# Altium schematic sheet ESP32 with USBC.SchDoc (part 2 of 3)
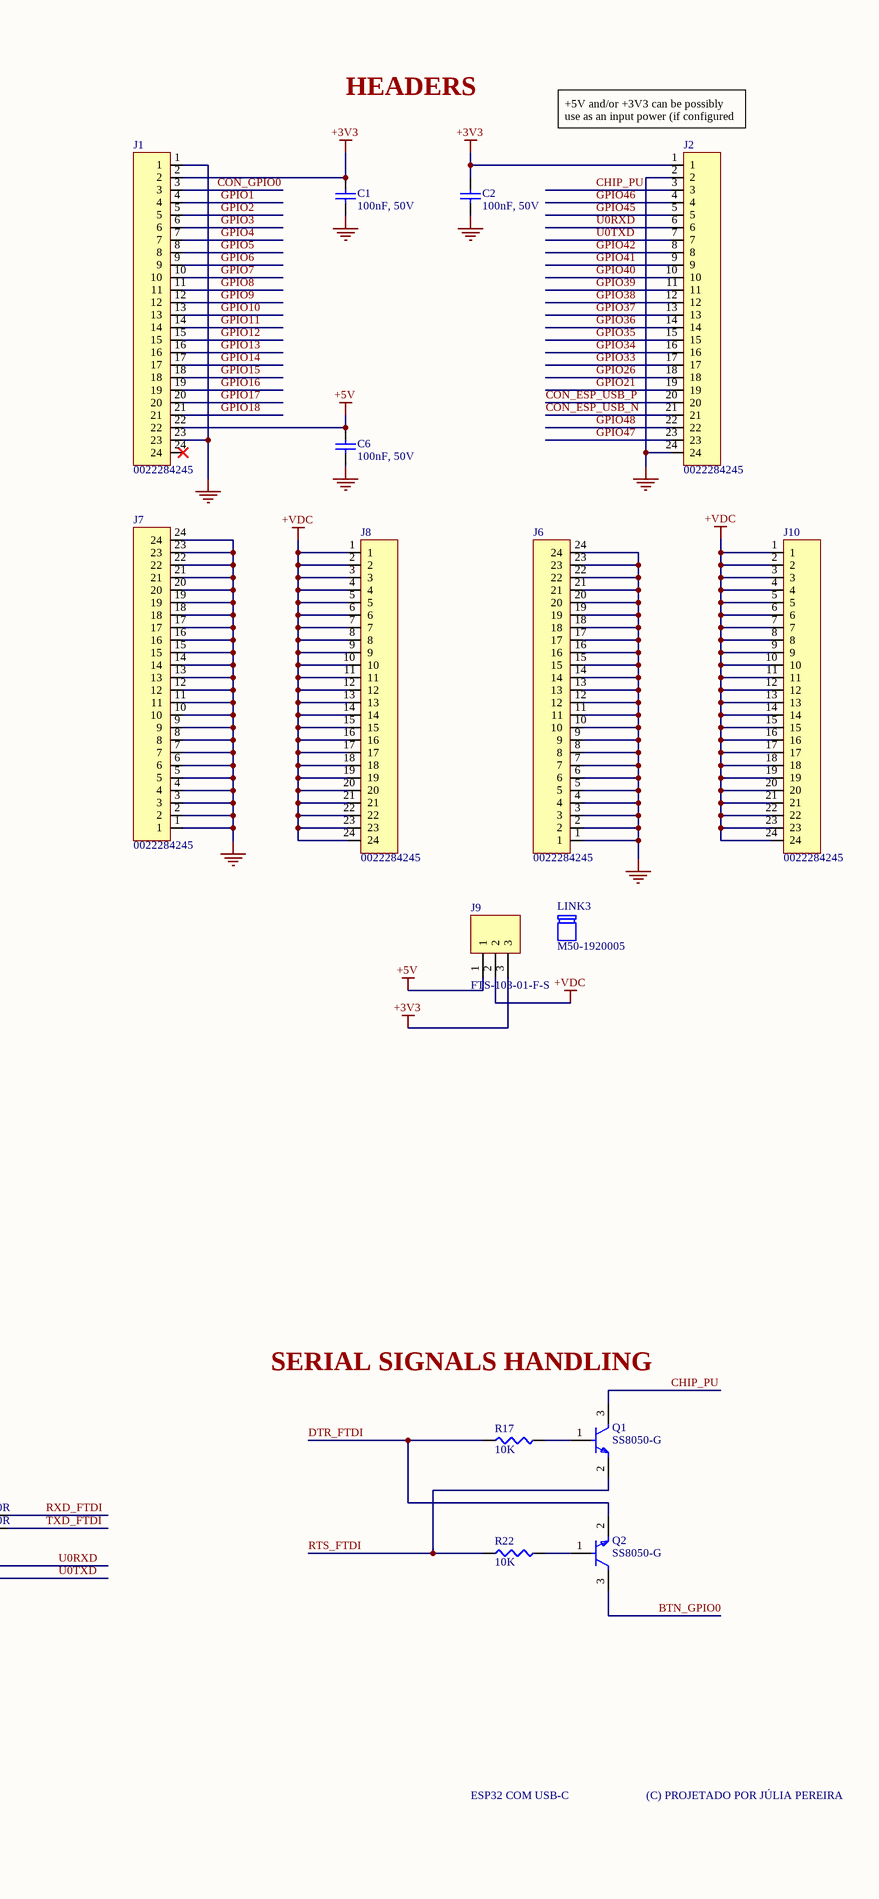
[diagram p2: ESP32 with USBC.SchDoc, right]
## Library data of the parts
C1 C2 C4-C7 C9 C10 C15 C17 = CL05B104KB54PNC: CAP CER 0.1UF 50V X7R 0402; Manufacturer: Samsung Electro-Mechanics; Dielectric Material: Ceramic; Tolerance: 10%; Supplier: DigiKey; Supplier Part Number: 1276-CL05B104KB54PNCCT-ND; Manufacturer Part Number: CL05B104KB54PNC; RoHS: Compliant; Category: Ceramic Capacitors; Stock: 403524; Pricing: 1=0.1, 10=0.048, 50=0.0326, 100=0.0279, 500=0.02002 (USD); Value: 100nF; Case/Package: 0402; China RoHS: Compliant; Country of Origin: Mainland China, Philippines, South Korea; Export Control Classification Number (ECCN) Code: EAR99; Height: 500µm; Harmonized Tariff Schedule (HTS) Code: 8532.24.00.20; Introduction Date: 2018-07-31; Length: 1mm; Lifecycle Status: Production; Material: Ceramic; Max Operating Temperature: 125°C; Min Operating Temperature: -55°C; Mounting Technology: Surface Mount; Number of Terminals: 2; Ratings: AEC-Q200; REACH SVHC: Yes; Schedule B: 8532240020, 8532240020|8532240020|8532240020|8532240020|8532240020|8532240020|8532240020|8532240020|8532240020|8532240020|8532240020|8532240020|8532240020|8532240020|8532240020|8532240020|8532240020|8532240020|8532240020|8532240020|8532240020|8532240020|8532240020|85; Voltage Rating: 50V; Voltage Rating (DC): 50V; Width: 500µm; ComponentLink1URL: https://datasheet.octopart.com:443/CL05B104KB54PNC-Samsung-Electro-Mechanics-datasheet-182018727.pdf?src-supplier=IHS; ComponentLink1Description: https://datasheet.octopart.com:443/CL05B104KB54PNC-Samsung-Electro-Mechanics-datasheet-182018727.pdf?src-supplier=IHS; ComponentLink2URL: https://datasheet.octopart.com:443/CL05B104KB54PNC-Samsung-Electro-Mechanics-datasheet-138685816.pdf?src-supplier=Samsung+SCT; ComponentLink2Description: https://datasheet.octopart.com:443/CL05B104KB54PNC-Samsung-Electro-Mechanics-datasheet-138685816.pdf?src-supplier=Samsung+SCT; ComponentLink3URL: https://datasheet.octopart.com:443/CL05B104KB54PNC-Samsung-datasheet-8326407.pdf?src-supplier=TME; ComponentLink3Description: https://datasheet.octopart.com:443/CL05B104KB54PNC-Samsung-datasheet-8326407.pdf?src-supplier=TME
C3 C8 C13 C18 = CL05A475MO5NUNC: 4.7 µF ±20% 16V Capacitor de cerâmica X5R 0402 (métrico 1005); Manufacturer: Samsung Electro-Mechanics; Value: 4.7µF; Dielectric Material: Ceramic; Supplier: DigiKey; Supplier Part Number: 1276-6836-6-ND; Manufacturer Part Number: CL05A475MO5NUNC; RoHS: Compliant; Category: Ceramic Capacitors; Stock: 1034605; Pricing: 1=0.52, 10=0.316, 50=0.2358, 100=0.211, 500=0.16936 (USD); Case/Package: 0402; Case Code (Imperial): 0402; Case Code (Metric): 1005; China RoHS: Compliant; Dielectric: X5R; Height: 500µm; Length: 1mm; Lifecycle Status: Production; Material: Ceramic; Max Operating Temperature: 85°C; Min Operating Temperature: -55°C; Mounting Technology: Surface Mount; Number of Terminals: 2; REACH SVHC: Yes; Schedule B: 8532240020, 8532240020|8532240020, 8532240020|8532240020|8532240020, 8532240020|8532240020|8532240020|8532240020; Thickness: 558.8µm; Tolerance: 20%; Voltage Rating: 16V; Voltage Rating (DC): 16V; Width: 500µm; ComponentLink1URL: https://datasheet.octopart.com:443/CL05A475MO5NUNC-Samsung-Electro-Mechanics-datasheet-178175196.pdf?src-supplier=Farnell; ComponentLink1Description: https://datasheet.octopart.com:443/CL05A475MO5NUNC-Samsung-Electro-Mechanics-datasheet-178175196.pdf?src-supplier=Farnell; ComponentLink2URL: https://datasheet.octopart.com:443/CL05A475MO5NUNC-Samsung-Electro-Mechanics-datasheet-123102911.pdf?src-supplier=Future+Electronics; ComponentLink2Description: https://datasheet.octopart.com:443/CL05A475MO5NUNC-Samsung-Electro-Mechanics-datasheet-123102911.pdf?src-supplier=Future+Electronics; ComponentLink3URL: https://datasheet.octopart.com:443/CL05A475MO5NUNC-Samsung-Electro-Mechanics-datasheet-110226225.pdf?src-supplier=Future+Electronics; ComponentLink3Description: https://datasheet.octopart.com:443/CL05A475MO5NUNC-Samsung-Electro-Mechanics-datasheet-110226225.pdf?src-supplier=Future+Electronics; ComponentLink4URL: https://datasheet.octopart.com:443/CL05A475MO5NUNC-Samsung-Electro-Mechanics-datasheet-83567908.pdf?src-supplier=Future+Electronics; ComponentLink4Description: https://datasheet.octopart.com:443/CL05A475MO5NUNC-Samsung-Electro-Mechanics-datasheet-83567908.pdf?src-supplier=Future+Electronics; ComponentLink5URL: https://datasheet.octopart.com:443/CL05A475MO5NUNC-Samsung-Electro-Mechanics-datasheet-68297032.pdf?src-supplier=Future+Electronics; ComponentLink5Description: https://datasheet.octopart.com:443/CL05A475MO5NUNC-Samsung-Electro-Mechanics-datasheet-68297032.pdf?src-supplier=Future+Electronics; ComponentLink6URL: https://datasheet.octopart.com:443/CL05A475MO5NUNC-Samsung-Electro-Mechanics-datasheet-87580057.pdf?src-supplier=Future+Electronics; ComponentLink6Description: https://datasheet.octopart.com:443/CL05A475MO5NUNC-Samsung-Electro-Mechanics-datasheet-87580057.pdf?src-supplier=Future+Electronics; ComponentLink7URL: https://datasheet.octopart.com:443/CL05A475MO5NUNC-Samsung-Electro-Mechanics-datasheet-149136694.pdf?src-supplier=Future+Electronics; ComponentLink7Description: https://datasheet.octopart.com:443/CL05A475MO5NUNC-Samsung-Electro-Mechanics-datasheet-149136694.pdf?src-supplier=Future+Electronics
C11 C12 C14 = CL05A106MP8NUB8: 10 µF ±20% 10V Capacitor de cerâmica X5R 0402 (métrico 1005); Manufacturer: Samsung Electro-Mechanics; Value: 10µF; Dielectric Material: Ceramic; Supplier: DigiKey; Supplier Part Number: 1276-6830-6-ND; Manufacturer Part Number: CL05A106MP8NUB8; RoHS: Compliant; Category: Ceramic Capacitors; Stock: 1026444; Pricing: 1=0.44, 10=0.26, 50=0.1902, 100=0.1688, 500=0.13288 (USD); Case/Package: 0402; Case Code (Imperial): 0402; Case Code (Metric): 1005; China RoHS: Compliant; Country of Origin: Mainland China, Philippines, South Korea; Export Control Classification Number (ECCN) Code: EAR99; Height: 800µm; Harmonized Tariff Schedule (HTS) Code: 8532.24.00.20; Introduction Date: 2014-02-27; Length: 1mm; Lifecycle Status: Production; Material: Ceramic; Max Operating Temperature: 85°C; Min Operating Temperature: -55°C; Mounting Technology: Surface Mount; Number of Terminals: 2; REACH SVHC: Yes; Schedule B: 8532240020, 8532240020|8532240020, 8532240020|8532240020|8532240020, 8532240020|8532240020|8532240020|8532240020; Thickness: 889µm; Tolerance: 20%; Voltage Rating: 10V; Voltage Rating (DC): 10V; Width: 500µm; ComponentLink1URL: https://datasheet.octopart.com:443/CL05A106MP8NUB8-Samsung-Electro-Mechanics-datasheet-136460857.pdf?src-supplier=IHS; ComponentLink1Description: https://datasheet.octopart.com:443/CL05A106MP8NUB8-Samsung-Electro-Mechanics-datasheet-136460857.pdf?src-supplier=IHS; ComponentLink2URL: https://datasheet.octopart.com:443/CL05A106MP8NUB8-Samsung-Electro-Mechanics-datasheet-181551178.pdf?src-supplier=Newark; ComponentLink2Description: https://datasheet.octopart.com:443/CL05A106MP8NUB8-Samsung-Electro-Mechanics-datasheet-181551178.pdf?src-supplier=Newark; ComponentLink3URL: https://datasheet.octopart.com:443/CL05A106MP8NUB8-Samsung-Electro-Mechanics-datasheet-136031724.pdf?src-supplier=Newark; ComponentLink3Description: https://datasheet.octopart.com:443/CL05A106MP8NUB8-Samsung-Electro-Mechanics-datasheet-136031724.pdf?src-supplier=Newark; ComponentLink4URL: https://datasheet.octopart.com:443/CL05A106MP8NUB8-Samsung-Electro-Mechanics-datasheet-141346815.pdf?src-supplier=Samsung+SCT; ComponentLink4Description: https://datasheet.octopart.com:443/CL05A106MP8NUB8-Samsung-Electro-Mechanics-datasheet-141346815.pdf?src-supplier=Samsung+SCT; ComponentLink5URL: https://datasheet.octopart.com:443/CL05A106MP8NUB8-Samsung-Electro-Mechanics-datasheet-110326781.pdf?src-supplier=Future+Electronics; ComponentLink5Description: https://datasheet.octopart.com:443/CL05A106MP8NUB8-Samsung-Electro-Mechanics-datasheet-110326781.pdf?src-supplier=Future+Electronics; ComponentLink6URL: https://datasheet.octopart.com:443/CL05A106MP8NUB8-Samsung-Electro-Mechanics-datasheet-96443587.pdf?src-supplier=Future+Electronics; ComponentLink6Description: https://datasheet.octopart.com:443/CL05A106MP8NUB8-Samsung-Electro-Mechanics-datasheet-96443587.pdf?src-supplier=Future+Electronics; ComponentLink7URL: https://datasheet.octopart.com:443/CL05A106MP8NUB8-Samsung-Electro-Mechanics-datasheet-68297032.pdf?src-supplier=Future+Electronics; ComponentLink7Description: https://datasheet.octopart.com:443/CL05A106MP8NUB8-Samsung-Electro-Mechanics-datasheet-68297032.pdf?src-supplier=Future+Electronics; ComponentLink8URL: https://datasheet.octopart.com:443/CL05A106MP8NUB8-Samsung-Electro-Mechanics-datasheet-86032222.pdf?src-supplier=Future+Electronics; ComponentLink8Description: https://datasheet.octopart.com:443/CL05A106MP8NUB8-Samsung-Electro-Mechanics-datasheet-86032222.pdf?src-supplier=Future+Electronics
C16 = CL05A105KL5NRNC: 1 µF ±10% 35V Capacitor de cerâmica X5R 0402 (métrico 1005); Manufacturer: Samsung Electro-Mechanics; Value: 1µF; Dielectric Material: Ceramic; Supplier: DigiKey; Supplier Part Number: 1276-6796-2-ND; Manufacturer Part Number: CL05A105KL5NRNC; RoHS: Compliant; Category: Ceramic Capacitors; Stock: 483880; Pricing: 10000=0.07511, 30000=0.06916 (USD); Case/Package: 0402; Case Code (Imperial): 0402; Case Code (Metric): 1005; China RoHS: Compliant; Country of Origin: Mainland China, Philippines, South Korea; Export Control Classification Number (ECCN) Code: EAR99; Height: 550µm; Harmonized Tariff Schedule (HTS) Code: 8532.24.00.20; Introduction Date: 2013-03-18; Length: 990.6µm; Lifecycle Status: Production; Material: Ceramic; Max Operating Temperature: 85°C; Min Operating Temperature: -55°C; Mounting Technology: Surface Mount; Number of Terminals: 2; REACH SVHC: Yes; Schedule B: 8532240020, 8532240020|8532240020|8532240020|8532240020|8532240020; Thickness: 558.8µm; Tolerance: 10%; Voltage Rating: 35V; Voltage Rating (DC): 35V; Width: 508µm; ComponentLink1URL: https://datasheet.octopart.com:443/CL05A105KL5NRNC-Samsung-Electro-Mechanics-datasheet-182018568.pdf?src-supplier=IHS; ComponentLink1Description: https://datasheet.octopart.com:443/CL05A105KL5NRNC-Samsung-Electro-Mechanics-datasheet-182018568.pdf?src-supplier=IHS; ComponentLink2URL: https://datasheet.octopart.com:443/CL05A105KL5NRNC-Samsung-Electro-Mechanics-datasheet-141346806.pdf?src-supplier=Samsung+SCT; ComponentLink2Description: https://datasheet.octopart.com:443/CL05A105KL5NRNC-Samsung-Electro-Mechanics-datasheet-141346806.pdf?src-supplier=Samsung+SCT; ComponentLink3URL: https://datasheet.octopart.com:443/CL05A105KL5NRNC-Samsung-datasheet-8326407.pdf?src-supplier=TME; ComponentLink3Description: https://datasheet.octopart.com:443/CL05A105KL5NRNC-Samsung-datasheet-8326407.pdf?src-supplier=TME
D1 = VLMTG1500-GS08: Verde 528nm Indicadores LED - Discreto 2,8V 0402 (métrico 1005); Manufacturer: Vishay; Forward Current: 20mA; Forward Voltage: 3.1V; Luminous Intensity: 28mcd; Number of Circuits: 1; Peak Wavelength: 527.5nm; Reverse Voltage: 5V; Shape: Rectangular; Viewing Angle: 130°; Supplier: DigiKey; Supplier Part Number: 751-VLMTG1500-GS08CT-ND; Manufacturer Part Number: VLMTG1500-GS08; RoHS: Compliant; Category: LEDs; Stock: 82551; Pricing: 1=0.35, 10=0.238, 100=0.1681, 500=0.1365, 1000=0.12606 (USD); Country of Origin: Mainland China; Height: 350µm; Harmonized Tariff Schedule (HTS) Code: 8541.40.20.00; Introduction Date: 2017-05-22; Lifecycle Status: Production; Max Operating Temperature: 80°C; Min Operating Temperature: -20°C; Mounting Technology: Surface Mount; Number of Terminals: 2; Terminal Pitch: 675µm; ComponentLink1URL: https://datasheet.octopart.com:443/VLMTG1500-GS08-Vishay-datasheet-181477802.pdf?src-supplier=IHS; ComponentLink1Description: https://datasheet.octopart.com:443/VLMTG1500-GS08-Vishay-datasheet-181477802.pdf?src-supplier=IHS; ComponentLink2URL: http://sigma.octopart.com:80/rohs_statement/Vishay-company-15.pdf?src-supplier=Compliance+Statements; ComponentLink2Description: http://sigma.octopart.com:80/rohs_statement/Vishay-company-15.pdf?src-supplier=Compliance+Statements
D2 D5 D6 = VLMS1500-GS08: LED Uni-Color Super Red 639nm 2-Pin Chip 0402(1006Metric) T/R; Manufacturer: Vishay; Dominant Wavelength: 631nm; Forward Current: 30mA; Forward Voltage: 2.4V; Lens Style: Rectangular, Square; Luminous Intensity: 18mcd; Number of Circuits: 1; Power Rating: 75mW; Reverse Voltage: 5V; Shape: Rectangular; Test Current: 20mA; Viewing Angle: 130°; Supplier: DigiKey; Supplier Part Number: VLMS1500-GS08CT-ND; Manufacturer Part Number: VLMS1500-GS08; RoHS: Compliant; Category: LEDs; Stock: 92678; Pricing: 1=0.26, 10=0.177, 100=0.1241, 500=0.09986, 1000=0.09182 (USD); Case/Package: 0402; Case Code (Imperial): 0402; Case Code (Metric): 1005; Color: Red; Country of Origin: Mainland China; Height: 350µm; Harmonized Tariff Schedule (HTS) Code: 8541.40.20.00; Illumination Color: Red; Introduction Date: 2012-07-08; Lead Free: Lead Free; Length: 1mm; Lifecycle Status: Production; Max Operating Temperature: 85°C; Min Operating Temperature: -30°C; Mounting Technology: Surface Mount; Number of LEDs: 1; Pins: 2; Number of Terminals: 2; Packaging: Cut Tape; Peak Wavelength: 631nm; Radiation Hardening: No; REACH SVHC: Yes; Schedule B: 8541402000, 8541402000|8541402000|8541402000|8541402000|8541402000; Terminal Pitch: 675µm; Wavelength: 631nm; Width: 500µm; ComponentLink1URL: https://datasheet.octopart.com:443/VLMS1500-GS08-Vishay-datasheet-181477802.pdf?src-supplier=IHS; ComponentLink1Description: https://datasheet.octopart.com:443/VLMS1500-GS08-Vishay-datasheet-181477802.pdf?src-supplier=IHS; ComponentLink2URL: https://datasheet.octopart.com:443/VLMS1500-GS08-Vishay-datasheet-21227148.pdf?src-supplier=Future+Electronics; ComponentLink2Description: https://datasheet.octopart.com:443/VLMS1500-GS08-Vishay-datasheet-21227148.pdf?src-supplier=Future+Electronics; ComponentLink3URL: https://datasheet.octopart.com:443/VLMS1500-GS08-Vishay-datasheet-102762782.pdf?src-supplier=Future+Electronics; ComponentLink3Description: https://datasheet.octopart.com:443/VLMS1500-GS08-Vishay-datasheet-102762782.pdf?src-supplier=Future+Electronics; ComponentLink4URL: https://datasheet.octopart.com:443/VLMS1500-GS08-Vishay-datasheet-33014519.pdf?src-supplier=element14+APAC; ComponentLink4Description: https://datasheet.octopart.com:443/VLMS1500-GS08-Vishay-datasheet-33014519.pdf?src-supplier=element14+APAC; ComponentLink5URL: https://datasheet.octopart.com:443/VLMS1500-GS08-Vishay-datasheet-68326145.pdf?src-supplier=TME; ComponentLink5Description: https://datasheet.octopart.com:443/VLMS1500-GS08-Vishay-datasheet-68326145.pdf?src-supplier=TME; ComponentLink6URL: https://datasheet.octopart.com:443/VLMS1500-GS08-Vishay-Siliconix-datasheet-62309867.pdf?src-supplier=RS+(Formerly+Allied+Electronics); ComponentLink6Description: https://datasheet.octopart.com:443/VLMS1500-GS08-Vishay-Siliconix-datasheet-62309867.pdf?src-supplier=RS+(Formerly+Allied+Electronics); ComponentLink7URL: https://datasheet.octopart.com:443/VLMS1500-GS08-Vishay-datasheet-62332426.pdf?src-supplier=Newark; ComponentLink7Description: https://datasheet.octopart.com:443/VLMS1500-GS08-Vishay-datasheet-62332426.pdf?src-supplier=Newark; ComponentLink8URL: https://datasheet.octopart.com/VLMS1500-GS08-Vishay-datasheet-16093911.pdf; ComponentLink8Description: https://datasheet.octopart.com/VLMS1500-GS08-Vishay-datasheet-16093911.pdf; ComponentLink9URL: http://sigma.octopart.com:80/rohs_statement/Vishay-company-15.pdf?src-supplier=Compliance+Statements; ComponentLink9Description: http://sigma.octopart.com:80/rohs_statement/Vishay-company-15.pdf?src-supplier=Compliance+Statements
D3 D4 = USBLC6-2SC6: STMicroelectronics Uni-Directional TVS Diode Array, 17V Vcl Max, SMD, SOT-23, 6V Vbr Min; Value: 2.5pF; Data Rate: 480Mbps; Direction: Unidirectional; Element Configuration: Dual; ESD Protection: Yes; Forward Voltage: 1.1V; Leakage Current: 150nA; Max Junction Temperature (Tj): 125°C; Max Repetitive Reverse Voltage (Vrrm): 5.25V; Number of Bidirectional Channels: 2; Number of Elements: 1; Peak Pulse Current: 5A; Reverse Standoff Voltage: 5V; Test Current: 1mA; Supplier: DigiKey; Supplier Part Number: 497-5235-6-ND; Manufacturer: STMicroelectronics; Manufacturer Part Number: USBLC6-2SC6; RoHS: Compliant; Category: TVS Diodes; Pricing: 1=0.54, 10=0.329, 50=0.2384, 100=0.2088, 500=0.15662 (USD); Breakdown Voltage: 6V; Case/Package: SOT-23; China RoHS: Compliant; Clamping Voltage: 17V; Contact Plating: Tin; Country of Origin: Mainland China; Depth: 1.75mm; Export Control Classification Number (ECCN) Code: EAR99; Height: 1.45mm; Harmonized Tariff Schedule (HTS) Code: 8541.10.00.50; Introduction Date: 2005-03-15; Lead Free: Lead Free; Length: 3.05mm; Lifecycle Status: Production; Max Breakdown Voltage: 6V; Max Operating Temperature: 125°C; Max Reverse Leakage Current: 150nA; Min Breakdown Voltage: 6V; Min Operating Temperature: -40°C; Mounting Technology: Surface Mount; Number of Channels: 2; Pins: 6; Number of Terminals: 6; Operating Supply Voltage: 1.1V; Peak Reverse Current: 150nA; Polarity: Unidirectional; Power Line Protection: Yes; Radiation Hardening: No; REACH SVHC: Yes; Reverse Breakdown Voltage: 6V; Schedule B: 8536300000, 8536300000|8536300000|8536300000|8536300000|8536300000|8536300000|8536300000|8536300000|8536300000|8536300000|8536300000|8536300000|8536300000|8536300000|8536300000|8536300000|8536300000|8536300000|8536300000|8536300000|8536300000|8536300000|8536300000|85; Termination: SMD/SMT; Width: 1.75mm; Working Voltage: 5V; ComponentLink1URL: https://datasheet.octopart.com:443/USBLC6-2SC6-STMicroelectronics-datasheet-10412581.pdf?src-supplier=Newark; ComponentLink1Description: https://datasheet.octopart.com:443/USBLC6-2SC6-STMicroelectronics-datasheet-10412581.pdf?src-supplier=Newark; ComponentLink2URL: https://datasheet.octopart.com:443/USBLC6-2SC6-STMicroelectronics-datasheet-181961833.pdf?src-supplier=Newark; ComponentLink2Description: https://datasheet.octopart.com:443/USBLC6-2SC6-STMicroelectronics-datasheet-181961833.pdf?src-supplier=Newark; ComponentLink3URL: https://datasheet.octopart.com:443/USBLC6-2SC6-STMicroelectronics-datasheet-525477.pdf?src-supplier=Factory+Futures; ComponentLink3Description: https://datasheet.octopart.com:443/USBLC6-2SC6-STMicroelectronics-datasheet-525477.pdf?src-supplier=Factory+Futures; ComponentLink4URL: https://datasheet.octopart.com:443/USBLC6-2SC6-STMicroelectronics-datasheet-82998616.pdf?src-supplier=Farnell; ComponentLink4Description: https://datasheet.octopart.com:443/USBLC6-2SC6-STMicroelectronics-datasheet-82998616.pdf?src-supplier=Farnell; ComponentLink5URL: https://datasheet.octopart.com:443/USBLC6-2SC6-STMicroelectronics-datasheet-46285.pdf?src-supplier=Farnell; ComponentLink5Description: https://datasheet.octopart.com:443/USBLC6-2SC6-STMicroelectronics-datasheet-46285.pdf?src-supplier=Farnell; ComponentLink6URL: https://datasheet.octopart.com:443/USBLC6-2SC6-STMicroelectronics-datasheet-14050643.pdf?src-supplier=iiiC; ComponentLink6Description: https://datasheet.octopart.com:443/USBLC6-2SC6-STMicroelectronics-datasheet-14050643.pdf?src-supplier=iiiC; ComponentLink7URL: https://datasheet.octopart.com:443/USBLC6-2SC6-STMicroelectronics-datasheet-10521292.pdf?src-supplier=Jameco+(USA); ComponentLink7Description: https://datasheet.octopart.com:443/USBLC6-2SC6-STMicroelectronics-datasheet-10521292.pdf?src-supplier=Jameco+(USA)
J1 J2 J6-J8 J10 = 0022284245: Conector barra de pinos Furo passante 24 position 0,100" (2,54mm); Manufacturer: Molex; Manufacturer Lifecycle Status: ACTIVE; Contact Resistance: 10mΩ; Current Rating: 4A; Gender: Male; Insulation Resistance: 1GΩ; Number of Circuits: 24; Operating Force: 4.9N; Pitch: 2.54mm; Plating: Tin; Plating Thickness: 381nm; Ratings: CSA; Supplier: DigiKey; Supplier Part Number: 900-0022284245-ND; Manufacturer Part Number: 22-28-4245; RoHS: Compliant; Category: Headers and Wire Housings; Stock: 574; Pricing: 1=4.05, 10=3.444, 100=2.9267, 500=2.61254, 1000=2.48792 (USD); China RoHS: Compliant; Color: Black; Contact Material: Brass; Contact Plating: Gold; Country of Origin: US; Export Control Classification Number (ECCN) Code: EAR99; Housing Color: Black; Harmonized Tariff Schedule (HTS) Code: 8536.69.40.40; Insulation Color: Black; Introduction Date: 1994-12-01; Lead Free: Lead Free; Lifecycle Status: Production; Max Operating Temperature: 75°C; Min Operating Temperature: -40°C; Mounting Technology: Through Hole; Number of Contacts: 24; Pins: 24; Number of Positions: 24; Number of Rows: 1; Orientation: Vertical; Packaging: Bulk; REACH SVHC: Yes; Schedule B: 8536694040, 8536694040|8536694040|8536694040|8536694040|8536694040; Terminal Pitch: 2.54mm; Termination: Solder; ComponentLink1URL: https://datasheet.octopart.com:443/22-28-4245-Molex-datasheet-166051265.pdf?src-supplier=IHS; ComponentLink1Description: https://datasheet.octopart.com:443/22-28-4245-Molex-datasheet-166051265.pdf?src-supplier=IHS; ComponentLink2URL: https://datasheet.octopart.com:443/022284245-Molex-datasheet-8337137.pdf?src-supplier=Arrow+Electronics; ComponentLink2Description: https://datasheet.octopart.com:443/022284245-Molex-datasheet-8337137.pdf?src-supplier=Arrow+Electronics; ComponentLink3URL: https://datasheet.octopart.com:443/22-28-4245-Molex-datasheet-16300812.pdf?src-supplier=Molex; ComponentLink3Description: https://datasheet.octopart.com:443/22-28-4245-Molex-datasheet-16300812.pdf?src-supplier=Molex; ComponentLink4URL: https://sigma.octopart.com:443/16300370/technical_drawing/Molex-22-28-4245.pdf?src-supplier=Molex; ComponentLink4Description: https://sigma.octopart.com:443/16300370/technical_drawing/Molex-22-28-4245.pdf?src-supplier=Molex; ComponentLink5URL: https://datasheet.octopart.com:443/22-28-4245-Molex-datasheet-4210.pdf?src-supplier=DigiKey; ComponentLink5Description: https://datasheet.octopart.com:443/22-28-4245-Molex-datasheet-4210.pdf?src-supplier=DigiKey; ComponentLink6URL: http://sigma.octopart.com:80/16300813/rohs_statement/Molex-22-28-4245.pdf?src-supplier=Compliance+Statements; ComponentLink6Description: http://sigma.octopart.com:80/16300813/rohs_statement/Molex-22-28-4245.pdf?src-supplier=Compliance+Statements; ComponentLink7URL: http://sigma.octopart.com:80/reach_statement/Molex-company-74.pdf?src-supplier=Compliance+Statements; ComponentLink7Description: http://sigma.octopart.com:80/reach_statement/Molex-company-74.pdf?src-supplier=Compliance+Statements; ComponentLink8URL: http://sigma.octopart.com:80/rohs_statement/Molex-company-73.pdf?src-supplier=Compliance+Statements; ComponentLink8Description: http://sigma.octopart.com:80/rohs_statement/Molex-company-73.pdf?src-supplier=Compliance+Statements; ComponentLink9URL: http://sigma.octopart.com:80/conflict_mineral_statement/Molex-company-72.pdf?src-supplier=Compliance+Statements; ComponentLink9Description: http://sigma.octopart.com:80/conflict_mineral_statement/Molex-company-72.pdf?src-supplier=Compliance+Statements
J3 J4 = 217179-0001: USB-C (USB Tipo-C) USB 2.0 Receptáculo Conector 24 (16+8 fictícios) Posição Montagem em superfície, ângulo reto; furo passante; Manufacturer: Molex; Contact Resistance: 50mΩ; Current Rating: 1.25A; Dielectric Material: Polyamide; Gender: Female; Insulation Resistance: 100MΩ; Number of Contacts: 16; Number of Ports: 1; USB Standard: USB 2.0; Voltage Rating: 30V; Supplier: DigiKey; Supplier Part Number: 900-2171790001CT-ND; Manufacturer Part Number: 217179-0001; RoHS: Compliant; Category: USB Connectors; Stock: 59793; Pricing: 1=0.83, 10=0.704, 25=0.6596, 50=0.628, 100=0.598, 250=0.56052, 500=0.53374 (USD); China RoHS: Compliant; Contact Material: Gold, Nickel; Country of Origin: Mainland China; Export Control Classification Number (ECCN) Code: EAR99; Height: 3.36mm; Harmonized Tariff Schedule (HTS) Code: 8536.69.40.30; Insulation Color: Black; Introduction Date: 2021-08-30; Lifecycle Status: Production; Max Operating Temperature: 85°C; Min Operating Temperature: -40°C; Number of Positions: 16; Number of Rows: 1; Orientation: Right Angle; REACH SVHC: Yes; Shell Finish: Nickel; Shell Material: Stainless Steel; Terminal Pitch: 500µm; ComponentLink1URL: https://datasheet.octopart.com:443/217179-0001-Molex-datasheet-158871109.pdf?src-supplier=ODG+(Origin+Data+Global); ComponentLink1Description: https://datasheet.octopart.com:443/217179-0001-Molex-datasheet-158871109.pdf?src-supplier=ODG+(Origin+Data+Global); ComponentLink2URL: https://sigma.octopart.com:443/158871110/technical_drawing/Molex-217179-0001.pdf?src-supplier=Upverter; ComponentLink2Description: https://sigma.octopart.com:443/158871110/technical_drawing/Molex-217179-0001.pdf?src-supplier=Upverter; ComponentLink3URL: https://datasheet.octopart.com:443/217179-0001-Molex-datasheet-164573281.pdf?src-supplier=RS+(Formerly+Allied+Electronics); ComponentLink3Description: https://datasheet.octopart.com:443/217179-0001-Molex-datasheet-164573281.pdf?src-supplier=RS+(Formerly+Allied+Electronics); ComponentLink4URL: http://sigma.octopart.com:80/reach_statement/Molex-company-74.pdf?src-supplier=Compliance+Statements; ComponentLink4Description: http://sigma.octopart.com:80/reach_statement/Molex-company-74.pdf?src-supplier=Compliance+Statements; ComponentLink5URL: http://sigma.octopart.com:80/rohs_statement/Molex-company-73.pdf?src-supplier=Compliance+Statements; ComponentLink5Description: http://sigma.octopart.com:80/rohs_statement/Molex-company-73.pdf?src-supplier=Compliance+Statements; ComponentLink6URL: http://sigma.octopart.com:80/conflict_mineral_statement/Molex-company-72.pdf?src-supplier=Compliance+Statements; ComponentLink6Description: http://sigma.octopart.com:80/conflict_mineral_statement/Molex-company-72.pdf?src-supplier=Compliance+Statements
J5 J9 = FTS-103-01-F-S: Conector barra de pinos Furo passante 3 position 0,050" (1,27mm); Manufacturer: Samtec; Manufacturer Lifecycle Status: PRODUCTION; Gender: Male; Number of Contacts: 3; Pitch: 1.27mm; Supplier: DigiKey; Supplier Part Number: 612-FTS-103-01-F-S-ND; Manufacturer Part Number: FTS-103-01-F-S; RoHS: Compliant; Category: Board to Board Connectors; Stock: 3333; Pricing: 1=0.73, 50=0.638, 100=0.541, 500=0.449, 1000=0.384, 2000=0.314, 5000=0.30344 (USD); Contact Plating: Gold; Lifecycle Status: Production; Mounting Technology: Through Hole; Number of Rows: 1; Packaging: Bulk; Radiation Hardening: No; Termination: Solder; ComponentLink1URL: https://datasheet.octopart.com:443/FTS-103-01-F-S-Samtec-datasheet-97029283.pdf?src-supplier=Newark; ComponentLink1Description: https://datasheet.octopart.com:443/FTS-103-01-F-S-Samtec-datasheet-97029283.pdf?src-supplier=Newark; ComponentLink2URL: https://datasheet.octopart.com:443/FTS-103-01-F-S-Samtec-datasheet-165596534.pdf?src-supplier=Newark; ComponentLink2Description: https://datasheet.octopart.com:443/FTS-103-01-F-S-Samtec-datasheet-165596534.pdf?src-supplier=Newark; ComponentLink3URL: https://sigma.octopart.com:443/97029285/technical_drawing/Samtec-FTS-103-01-F-S.pdf?src-supplier=element14+APAC; ComponentLink3Description: https://sigma.octopart.com:443/97029285/technical_drawing/Samtec-FTS-103-01-F-S.pdf?src-supplier=element14+APAC; ComponentLink4URL: https://datasheet.octopart.com:443/FTS-103-01-F-S-Samtec-datasheet-118493358.pdf?src-supplier=Electro+Sonic; ComponentLink4Description: https://datasheet.octopart.com:443/FTS-103-01-F-S-Samtec-datasheet-118493358.pdf?src-supplier=Electro+Sonic; ComponentLink5URL: https://datasheet.octopart.com:443/FTS-103-01-F-S-Samtec-datasheet-176663378.pdf?src-supplier=Toby+Electronics; ComponentLink5Description: https://datasheet.octopart.com:443/FTS-103-01-F-S-Samtec-datasheet-176663378.pdf?src-supplier=Toby+Electronics; ComponentLink6URL: https://datasheet.octopart.com:443/FTS-103-01-F-S-Samtec-datasheet-116535195.pdf?src-supplier=Toby+Electronics; ComponentLink6Description: https://datasheet.octopart.com:443/FTS-103-01-F-S-Samtec-datasheet-116535195.pdf?src-supplier=Toby+Electronics; ComponentLink7URL: https://datasheet.octopart.com:443/FTS-103-01-F-S-Samtec-datasheet-136395376.pdf?src-supplier=Toby+Electronics; ComponentLink7Description: https://datasheet.octopart.com:443/FTS-103-01-F-S-Samtec-datasheet-136395376.pdf?src-supplier=Toby+Electronics; ComponentLink8URL: https://datasheet.octopart.com:443/FTS-103-01-F-S-Samtec-datasheet-151470456.pdf?src-supplier=Sager+Electronics; ComponentLink8Description: https://datasheet.octopart.com:443/FTS-103-01-F-S-Samtec-datasheet-151470456.pdf?src-supplier=Sager+Electronics
LINK1 LINK3 = M50-1920005: 2 (1 x 2) Conector Shunt com posição Vermelho Topo fechado 0,050" (1,27mm) Ouro; Manufacturer: Harwin; Contact Resistance: 20mΩ; Current Rating: 1A; Gender: Female; Insulation Resistance: 1GΩ; Number of Positions: 2; Pitch: 1.27mm; Voltage Rating: 500V; Supplier: DigiKey; Supplier Part Number: 952-1727-ND; Manufacturer Part Number: M50-1920005; RoHS: Compliant; Category: Shunts and Jumpers; Stock: 14283; Pricing: 1=0.35, 10=0.296, 25=0.2768, 50=0.2638, 100=0.2511, 250=0.23532, 500=0.22408, 1000=0.21336, 3000=0.19744 (USD); Color: Red; Contact Plating: Gold; Country of Origin: Mainland China; Export Control Classification Number (ECCN) Code: EAR99; Flammability Rating: UL94 V-0; Height: 2.9972mm; Housing Material: Nylon; Insulation Color: Red; Introduction Date: 2011-08-01; Lifecycle Status: Production; Max Operating Temperature: 105°C; Min Operating Temperature: -40°C; Pins: 2; Orientation: Straight; REACH SVHC: Yes; ComponentLink1URL: https://datasheet.octopart.com:443/M50-1920005-Harwin-datasheet-179992058.pdf?src-supplier=IHS; ComponentLink1Description: https://datasheet.octopart.com:443/M50-1920005-Harwin-datasheet-179992058.pdf?src-supplier=IHS; ComponentLink2URL: https://datasheet.octopart.com:443/M50-1920005-Harwin-datasheet-27707384.pdf?src-supplier=Newark; ComponentLink2Description: https://datasheet.octopart.com:443/M50-1920005-Harwin-datasheet-27707384.pdf?src-supplier=Newark; ComponentLink3URL: https://datasheet.octopart.com:443/M50-1920005-Harwin-datasheet-10841850.pdf?src-supplier=element14+APAC; ComponentLink3Description: https://datasheet.octopart.com:443/M50-1920005-Harwin-datasheet-10841850.pdf?src-supplier=element14+APAC
Q1 Q2 = SS8050-G: Transístor bipolar (BJT) NPN 25 V 1.5 A 100MHz 300 mW Montagem em superfície SOT-23-3; Manufacturer: Comchip; Collector Base Voltage (VCBO): 40V; Collector Emitter Breakdown Voltage: 25V; Collector Emitter Saturation Voltage: 500mV; Emitter Base Voltage (VEBO): 5V; hFE Min: 40; Max Collector Current: 1.5A; Max Junction Temperature (Tj): 150°C; Max Power Dissipation: 300mW; Number of Elements: 1; Supplier: DigiKey; Supplier Part Number: 641-1790-1-ND; Manufacturer Part Number: SS8050-G; RoHS: Compliant; Category: BJTs; Pricing: 1=0.26, 10=0.157, 100=0.0976, 500=0.0716, 1000=0.06315 (USD); Case/Package: TO-236-3; Collector Emitter Voltage (VCEO): 25V; Height: 1.15mm; Lifecycle Status: Production; Max Breakdown Voltage: 25V; Max Operating Temperature: 150°C; Mounting Technology: Surface Mount; Number of Terminals: 3; Power Dissipation: 300mW; REACH SVHC: Yes; Schedule B: 8541100070|8541100070|8541100070|8541100070|8541100070; Transition Frequency: 100MHz; ComponentLink1URL: https://datasheet.octopart.com:443/SS8050-G-Comchip-datasheet-180131983.pdf?src-supplier=IHS; ComponentLink1Description: https://datasheet.octopart.com:443/SS8050-G-Comchip-datasheet-180131983.pdf?src-supplier=IHS; ComponentLink2URL: https://datasheet.octopart.com:443/SS8050-G-Comchip-datasheet-155422643.pdf?src-supplier=Upverter; ComponentLink2Description: https://datasheet.octopart.com:443/SS8050-G-Comchip-datasheet-155422643.pdf?src-supplier=Upverter; ComponentLink3URL: https://datasheet.octopart.com:443/SS8050-G-Comchip-datasheet-189767092.pdf?src-supplier=LCSC; ComponentLink3Description: https://datasheet.octopart.com:443/SS8050-G-Comchip-datasheet-189767092.pdf?src-supplier=LCSC
R1-R3 R7 R8 = RC0402FR-071KL: 1 kOhms ±1% 0,063W, 1/16W Resistor de chip 0402 (métrico 1005) Resistente à umidade Filme grosso; Manufacturer: Yageo Group; Power Rating: 62.5mW; Value: 1kΩ; Temperature Coefficient: 100ppm/°C; Voltage Rating: 50V; Supplier: DigiKey; Supplier Part Number: 311-1.00KLRDKR-ND; Manufacturer Part Number: RC0402FR-071KL; RoHS: Compliant; Category: Chip SMD Resistors; Stock: 9676262; Pricing: 1=0.1, 10=0.021, 25=0.0152, 50=0.012, 100=0.0097, 250=0.0074, 500=0.00612, 1000=0.00512, 5000=0.00355 (USD); Case/Package: 0402; Case Code (Imperial): 0402; Case Code (Metric): 0402; China RoHS: Non-Compliant; Composition: Thick Film; Contact Plating: Tin; Depth: 500µm; Height: 350µm; Lead Free: Lead Free; Length: 1mm; Lifecycle Status: Production; Max Operating Temperature: 155°C; Military Standard: Not; Min Operating Temperature: -55°C; Mounting Technology: Surface Mount; Pins: 2; Number of Terminals: 2; Packaging: Tape & Reel; Radiation Hardening: No; REACH SVHC: Yes; Schedule B: 8533210045, 8533210045|8533210045|8533210045|8533210045|8533210045|8533210045|8533210045|8533210045|8533210045|8533210045|8533210045|8533210045|8533210045|8533210045|8533210045|8533210045|8533210045|8533210045|8533210045|8533210045|8533210045|8533210045|8533210045|85; Termination: SMD/SMT; Tolerance: 1%; Voltage Rating (AC): 50V; Voltage Rating (DC): 50V; Width: 500µm; Working Voltage: 50V; ComponentLink1URL: https://datasheet.octopart.com:443/RC0402FR-071KL-Yageo-datasheet-175887523.pdf?src-supplier=Newark; ComponentLink1Description: https://datasheet.octopart.com:443/RC0402FR-071KL-Yageo-datasheet-175887523.pdf?src-supplier=Newark; ComponentLink2URL: https://datasheet.octopart.com:443/RC0402FR-071KL-Yageo-datasheet-10408619.pdf?src-supplier=Newark; ComponentLink2Description: https://datasheet.octopart.com:443/RC0402FR-071KL-Yageo-datasheet-10408619.pdf?src-supplier=Newark; ComponentLink3URL: https://datasheet.octopart.com:443/RC0402FR-071KL-Yageo-datasheet-8324527.pdf?src-supplier=Newark; ComponentLink3Description: https://datasheet.octopart.com:443/RC0402FR-071KL-Yageo-datasheet-8324527.pdf?src-supplier=Newark; ComponentLink4URL: https://datasheet.octopart.com:443/RC0402FR-071KL-Yageo-datasheet-164759695.pdf?src-supplier=Upverter; ComponentLink4Description: https://datasheet.octopart.com:443/RC0402FR-071KL-Yageo-datasheet-164759695.pdf?src-supplier=Upverter; ComponentLink5URL: https://datasheet.octopart.com:443/RC0402FR-071KL-Yageo-datasheet-103092701.pdf?src-supplier=Upverter; ComponentLink5Description: https://datasheet.octopart.com:443/RC0402FR-071KL-Yageo-datasheet-103092701.pdf?src-supplier=Upverter; ComponentLink6URL: https://sigma.octopart.com:443/138820526/technical_drawing/Yageo-RC0402FR-071KL.pdf?src-supplier=Upverter; ComponentLink6Description: https://sigma.octopart.com:443/138820526/technical_drawing/Yageo-RC0402FR-071KL.pdf?src-supplier=Upverter; ComponentLink7URL: https://datasheet.octopart.com:443/RC0402FR-071KL-Yageo-datasheet-98239111.pdf?src-supplier=Upverter; ComponentLink7Description: https://datasheet.octopart.com:443/RC0402FR-071KL-Yageo-datasheet-98239111.pdf?src-supplier=Upverter; ComponentLink8URL: https://datasheet.octopart.com:443/RC0402FR-071KL-Yageo-Group-datasheet-190305687.pdf?src-supplier=Future+Electronics; ComponentLink8Description: https://datasheet.octopart.com:443/RC0402FR-071KL-Yageo-Group-datasheet-190305687.pdf?src-supplier=Future+Electronics; ComponentLink9URL: https://datasheet.octopart.com:443/RC0402FR-071KL-Yageo-datasheet-12531192.pdf?src-supplier=Future+Electronics; ComponentLink9Description: https://datasheet.octopart.com:443/RC0402FR-071KL-Yageo-datasheet-12531192.pdf?src-supplier=Future+Electronics; ComponentLink10URL: https://datasheet.octopart.com:443/RC0402FR-071KL-Yageo-datasheet-137700087.pdf?src-supplier=Future+Electronics; ComponentLink10Description: https://datasheet.octopart.com:443/RC0402FR-071KL-Yageo-datasheet-137700087.pdf?src-supplier=Future+Electronics; ComponentLink11URL: https://datasheet.octopart.com:443/RC0402FR-071KL-Yageo-datasheet-8324255.pdf?src-supplier=Future+Electronics; ComponentLink11Description: https://datasheet.octopart.com:443/RC0402FR-071KL-Yageo-datasheet-8324255.pdf?src-supplier=Future+Electronics; ComponentLink12URL: https://datasheet.octopart.com:443/RC0402FR-071KL-Yageo-datasheet-62067350.pdf?src-supplier=Farnell; ComponentLink12Description: https://datasheet.octopart.com:443/RC0402FR-071KL-Yageo-datasheet-62067350.pdf?src-supplier=Farnell; ComponentLink13URL: https://datasheet.octopart.com:443/RC0402FR-071KL-Yageo-datasheet-8329306.pdf?src-supplier=element14; ComponentLink13Description: https://datasheet.octopart.com:443/RC0402FR-071KL-Yageo-datasheet-8329306.pdf?src-supplier=element14; ComponentLink14URL: https://datasheet.octopart.com:443/RC0402FR-071KL-Yageo-datasheet-505231.pdf?src-supplier=element14; ComponentLink14Description: https://datasheet.octopart.com:443/RC0402FR-071KL-Yageo-datasheet-505231.pdf?src-supplier=element14; ComponentLink15URL: https://datasheet.octopart.com:443/RC0402FR-071KL-Yageo-datasheet-175423674.pdf?src-supplier=SOS+electronic; ComponentLink15Description: https://datasheet.octopart.com:443/RC0402FR-071KL-Yageo-datasheet-175423674.pdf?src-supplier=SOS+electronic; ComponentLink16URL: https://datasheet.octopart.com:443/RC0402FR-071KL-Yageo-datasheet-148775077.pdf?src-supplier=TME; ComponentLink16Description: https://datasheet.octopart.com:443/RC0402FR-071KL-Yageo-datasheet-148775077.pdf?src-supplier=TME; ComponentLink17URL: https://datasheet.octopart.com:443/RC0402FR-071KL-Yageo-datasheet-79472498.pdf?src-supplier=Megastar; ComponentLink17Description: https://datasheet.octopart.com:443/RC0402FR-071KL-Yageo-datasheet-79472498.pdf?src-supplier=Megastar; ComponentLink18URL: https://datasheet.octopart.com/RC0402FR-071KL-Yageo-datasheet-73766026.pdf; ComponentLink18Description: https://datasheet.octopart.com/RC0402FR-071KL-Yageo-datasheet-73766026.pdf; ComponentLink19URL: http://sigma.octopart.com:80/conflict_mineral_statement/Yageo-company-3.pdf?src-supplier=Compliance+Statements; ComponentLink19Description: http://sigma.octopart.com:80/conflict_mineral_statement/Yageo-company-3.pdf?src-supplier=Compliance+Statements; ComponentLink20URL: http://sigma.octopart.com:80/rohs_statement/Yageo-company-2.pdf?src-supplier=Compliance+Statements; ComponentLink20Description: http://sigma.octopart.com:80/rohs_statement/Yageo-company-2.pdf?src-supplier=Compliance+Statements
R9 = RC0402FR-074K7L: RES 4.7K OHM 1% 1/16W 0402; Manufacturer: Yageo Group; Power Rating: 62.5mW; Value: 4.7kΩ; Temperature Coefficient: 100ppm/°C; Voltage Rating: 50V; Supplier: DigiKey; Supplier Part Number: 311-4.7KLRDKR-ND; Manufacturer Part Number: RC0402FR-074K7L; RoHS: Compliant; Category: Chip SMD Resistors; Stock: 2941109; Pricing: 1=0.1, 10=0.021, 25=0.0152, 50=0.012, 100=0.0097, 250=0.0074, 500=0.00612, 1000=0.00512, 5000=0.00355 (USD); Case/Package: 0402; Case Code (Imperial): 0402; Case Code (Metric): 1005; China RoHS: Non-Compliant; Composition: Thick Film; Country of Origin: Mainland China, Taiwan; Depth: 500µm; Export Control Classification Number (ECCN) Code: EAR99; Height: 350µm; Harmonized Tariff Schedule (HTS) Code: 8533.21.00.30; Introduction Date: 2008-07-18; Lead Free: Lead Free; Length: 1mm; Lifecycle Status: Production; Max Operating Temperature: 155°C; Military Standard: Not; Min Operating Temperature: -55°C; Mounting Technology: Surface Mount; Pins: 2; Number of Terminals: 2; Packaging: Tape & Reel; REACH SVHC: Yes; Schedule B: 8533210045, 8533210045|8533210045, 8533210045|8533210045|8533210045, 8533210045|8533210045|8533210045|8533210045; Termination: SMD/SMT; Tolerance: 1%; Voltage Rating (AC): 50V; Voltage Rating (DC): 50V; Width: 500µm; Working Voltage: 50V; ComponentLink1URL: https://datasheet.octopart.com:443/RC0402FR-074K7L-Yageo-datasheet-175887523.pdf?src-supplier=IHS; ComponentLink1Description: https://datasheet.octopart.com:443/RC0402FR-074K7L-Yageo-datasheet-175887523.pdf?src-supplier=IHS; ComponentLink2URL: https://datasheet.octopart.com:443/RC0402FR-074K7L-Yageo-datasheet-103092701.pdf?src-supplier=Upverter; ComponentLink2Description: https://datasheet.octopart.com:443/RC0402FR-074K7L-Yageo-datasheet-103092701.pdf?src-supplier=Upverter; ComponentLink3URL: https://datasheet.octopart.com:443/RC0402FR-074K7L-Yageo-datasheet-98239111.pdf?src-supplier=Upverter; ComponentLink3Description: https://datasheet.octopart.com:443/RC0402FR-074K7L-Yageo-datasheet-98239111.pdf?src-supplier=Upverter; ComponentLink4URL: https://datasheet.octopart.com:443/RC0402FR-074K7L-Yageo-Group-datasheet-190305687.pdf?src-supplier=Future+Electronics; ComponentLink4Description: https://datasheet.octopart.com:443/RC0402FR-074K7L-Yageo-Group-datasheet-190305687.pdf?src-supplier=Future+Electronics; ComponentLink5URL: https://datasheet.octopart.com:443/RC0402FR-074K7L-Yageo-datasheet-164759695.pdf?src-supplier=Future+Electronics; ComponentLink5Description: https://datasheet.octopart.com:443/RC0402FR-074K7L-Yageo-datasheet-164759695.pdf?src-supplier=Future+Electronics; ComponentLink6URL: https://datasheet.octopart.com:443/RC0402FR-074K7L-Yageo-datasheet-137700087.pdf?src-supplier=Future+Electronics; ComponentLink6Description: https://datasheet.octopart.com:443/RC0402FR-074K7L-Yageo-datasheet-137700087.pdf?src-supplier=Future+Electronics; ComponentLink7URL: https://datasheet.octopart.com:443/RC0402FR-074K7L-Yageo-Group-datasheet-190051977.pdf?src-supplier=Newark; ComponentLink7Description: https://datasheet.octopart.com:443/RC0402FR-074K7L-Yageo-Group-datasheet-190051977.pdf?src-supplier=Newark; ComponentLink8URL: https://datasheet.octopart.com:443/RC0402FR-074K7L-Yageo-datasheet-12531192.pdf?src-supplier=Newark; ComponentLink8Description: https://datasheet.octopart.com:443/RC0402FR-074K7L-Yageo-datasheet-12531192.pdf?src-supplier=Newark; ComponentLink9URL: https://datasheet.octopart.com:443/RC0402FR-074K7L-Yageo-datasheet-8324527.pdf?src-supplier=Newark; ComponentLink9Description: https://datasheet.octopart.com:443/RC0402FR-074K7L-Yageo-datasheet-8324527.pdf?src-supplier=Newark; ComponentLink10URL: https://datasheet.octopart.com:443/RC0402FR-074K7L-Yageo-datasheet-10408619.pdf?src-supplier=element14+APAC; ComponentLink10Description: https://datasheet.octopart.com:443/RC0402FR-074K7L-Yageo-datasheet-10408619.pdf?src-supplier=element14+APAC; ComponentLink11URL: https://datasheet.octopart.com:443/RC0402FR-074K7L-Yageo-datasheet-13691069.pdf?src-supplier=element14+APAC; ComponentLink11Description: https://datasheet.octopart.com:443/RC0402FR-074K7L-Yageo-datasheet-13691069.pdf?src-supplier=element14+APAC; ComponentLink12URL: https://datasheet.octopart.com:443/RC0402FR-074K7L-Yageo-datasheet-62067350.pdf?src-supplier=Farnell; ComponentLink12Description: https://datasheet.octopart.com:443/RC0402FR-074K7L-Yageo-datasheet-62067350.pdf?src-supplier=Farnell; ComponentLink13URL: https://datasheet.octopart.com:443/RC0402FR-074K7L-Yageo-datasheet-8329306.pdf?src-supplier=element14; ComponentLink13Description: https://datasheet.octopart.com:443/RC0402FR-074K7L-Yageo-datasheet-8329306.pdf?src-supplier=element14; ComponentLink14URL: https://datasheet.octopart.com:443/RC0402FR-074K7L-Yageo-Group-datasheet-189192902.pdf?src-supplier=LCSC; ComponentLink14Description: https://datasheet.octopart.com:443/RC0402FR-074K7L-Yageo-Group-datasheet-189192902.pdf?src-supplier=LCSC; ComponentLink15URL: https://datasheet.octopart.com:443/RC0402FR-074K7L-Yageo-datasheet-175423674.pdf?src-supplier=SOS+electronic; ComponentLink15Description: https://datasheet.octopart.com:443/RC0402FR-074K7L-Yageo-datasheet-175423674.pdf?src-supplier=SOS+electronic; ComponentLink16URL: https://datasheet.octopart.com:443/RC0402FR-074K7L-Yageo-datasheet-79472498.pdf?src-supplier=Megastar; ComponentLink16Description: https://datasheet.octopart.com:443/RC0402FR-074K7L-Yageo-datasheet-79472498.pdf?src-supplier=Megastar; ComponentLink17URL: https://datasheet.octopart.com/RC0402FR-074K7L-Yageo-datasheet-73766026.pdf; ComponentLink17Description: https://datasheet.octopart.com/RC0402FR-074K7L-Yageo-datasheet-73766026.pdf; ComponentLink18URL: http://sigma.octopart.com:80/conflict_mineral_statement/Yageo-company-3.pdf?src-supplier=Compliance+Statements; ComponentLink18Description: http://sigma.octopart.com:80/conflict_mineral_statement/Yageo-company-3.pdf?src-supplier=Compliance+Statements; ComponentLink19URL: http://sigma.octopart.com:80/rohs_statement/Yageo-company-2.pdf?src-supplier=Compliance+Statements; ComponentLink19Description: http://sigma.octopart.com:80/rohs_statement/Yageo-company-2.pdf?src-supplier=Compliance+Statements
R11 R12 R14 R15 = AC0402FR-075K1L: 5.1 kOhms ±1% 0,063W, 1/16W Resistor de chip 0402 (métrico 1005) AEC-Q200 automotivo, resistente a umidade Filme grosso; Manufacturer: Yageo Group; Max Power Dissipation: 63mW; Power Rating: 62.5mW; Value: 5.1kΩ; Temperature Coefficient: 100ppm/°C; Voltage Rating: 50V; Supplier: DigiKey; Supplier Part Number: YAG3503DKR-ND; Manufacturer Part Number: AC0402FR-075K1L; RoHS: Compliant; Category: Chip SMD Resistors; Pricing: 1=0.11, 10=0.025, 25=0.0184, 50=0.0148, 100=0.012, 250=0.00928, 500=0.0077, 1000=0.00649, 5000=0.00457 (USD); Case/Package: 0402; Case Code (Imperial): 0402; Case Code (Metric): 1005; China RoHS: Non-Compliant; Composition: Thick Film; Country of Origin: Mainland China, Taiwan; Depth: 500µm; Export Control Classification Number (ECCN) Code: EAR99; Features: Automotive AEC-Q200, Moisture Resistant; Height: 320µm; Harmonized Tariff Schedule (HTS) Code: 8533.21.00.30; Introduction Date: 2012-04-10; Lead Free: Lead Free; Length: 1mm; Lifecycle Status: Production; Max Operating Temperature: 155°C; Military Standard: Not; Min Operating Temperature: -55°C; Mounting Technology: Surface Mount; Number of Terminals: 2; Number of Terminations: 2; Ratings: AEC-Q200; REACH SVHC: Yes; Schedule B: 8533210045, 8533210045|8533210045|8533210045|8533210045|8533210045|8533210045|8533210045|8533210045|8533210045|8533210045|8533210045|8533210045|8533210045|8533210045|8533210045|8533210045|8533210045|8533210045|8533210045|8533210045|8533210045|8533210045|8533210045|85; Tolerance: 1%; Width: 500µm; Working Voltage: 50V; ComponentLink1URL: https://datasheet.octopart.com:443/AC0402FR-075K1L-Yageo-datasheet-182189377.pdf?src-supplier=IHS; ComponentLink1Description: https://datasheet.octopart.com:443/AC0402FR-075K1L-Yageo-datasheet-182189377.pdf?src-supplier=IHS; ComponentLink2URL: https://datasheet.octopart.com:443/AC0402FR-075K1L-Yageo-datasheet-83209224.pdf?src-supplier=Upverter; ComponentLink2Description: https://datasheet.octopart.com:443/AC0402FR-075K1L-Yageo-datasheet-83209224.pdf?src-supplier=Upverter; ComponentLink3URL: https://datasheet.octopart.com:443/AC0402FR-075K1L-Yageo-datasheet-178509465.pdf?src-supplier=Newark; ComponentLink3Description: https://datasheet.octopart.com:443/AC0402FR-075K1L-Yageo-datasheet-178509465.pdf?src-supplier=Newark; ComponentLink4URL: https://datasheet.octopart.com/AC0402FR-075K1L-Yageo-datasheet-12512238.pdf; ComponentLink4Description: https://datasheet.octopart.com/AC0402FR-075K1L-Yageo-datasheet-12512238.pdf; ComponentLink5URL: https://datasheet.octopart.com:443/AC0402FR-075K1L-Yageo-Group-datasheet-189830439.pdf?src-supplier=Future+Electronics; ComponentLink5Description: https://datasheet.octopart.com:443/AC0402FR-075K1L-Yageo-Group-datasheet-189830439.pdf?src-supplier=Future+Electronics; ComponentLink6URL: https://datasheet.octopart.com:443/AC0402FR-075K1L-Yageo-datasheet-166720450.pdf?src-supplier=Future+Electronics; ComponentLink6Description: https://datasheet.octopart.com:443/AC0402FR-075K1L-Yageo-datasheet-166720450.pdf?src-supplier=Future+Electronics; ComponentLink7URL: https://datasheet.octopart.com:443/AC0402FR-075K1L-Yageo-datasheet-151884373.pdf?src-supplier=Future+Electronics; ComponentLink7Description: https://datasheet.octopart.com:443/AC0402FR-075K1L-Yageo-datasheet-151884373.pdf?src-supplier=Future+Electronics; ComponentLink8URL: https://datasheet.octopart.com:443/AC0402FR-075K1L-Yageo-datasheet-137699919.pdf?src-supplier=Future+Electronics; ComponentLink8Description: https://datasheet.octopart.com:443/AC0402FR-075K1L-Yageo-datasheet-137699919.pdf?src-supplier=Future+Electronics; ComponentLink9URL: https://datasheet.octopart.com:443/AC0402FR-075K1L-Yageo-datasheet-24580492.pdf?src-supplier=Future+Electronics; ComponentLink9Description: https://datasheet.octopart.com:443/AC0402FR-075K1L-Yageo-datasheet-24580492.pdf?src-supplier=Future+Electronics; ComponentLink10URL: https://datasheet.octopart.com:443/AC0402FR-075K1L-Yageo-datasheet-13029202.pdf?src-supplier=Future+Electronics; ComponentLink10Description: https://datasheet.octopart.com:443/AC0402FR-075K1L-Yageo-datasheet-13029202.pdf?src-supplier=Future+Electronics; ComponentLink11URL: https://datasheet.octopart.com:443/AC0402FR-075K1L-Yageo-Group-datasheet-188689268.pdf?src-supplier=LCSC; ComponentLink11Description: https://datasheet.octopart.com:443/AC0402FR-075K1L-Yageo-Group-datasheet-188689268.pdf?src-supplier=LCSC; ComponentLink12URL: https://datasheet.octopart.com:443/AC0402FR-075K1L-Yageo-Group-datasheet-164768995.pdf?src-supplier=ODG+(Origin+Data+Global); ComponentLink12Description: https://datasheet.octopart.com:443/AC0402FR-075K1L-Yageo-Group-datasheet-164768995.pdf?src-supplier=ODG+(Origin+Data+Global); ComponentLink13URL: http://sigma.octopart.com:80/conflict_mineral_statement/Yageo-company-3.pdf?src-supplier=Compliance+Statements; ComponentLink13Description: http://sigma.octopart.com:80/conflict_mineral_statement/Yageo-company-3.pdf?src-supplier=Compliance+Statements; ComponentLink14URL: http://sigma.octopart.com:80/rohs_statement/Yageo-company-2.pdf?src-supplier=Compliance+Statements; ComponentLink14Description: http://sigma.octopart.com:80/rohs_statement/Yageo-company-2.pdf?src-supplier=Compliance+Statements